# Altium schematic sheet 20180623.SchDoc
size A3
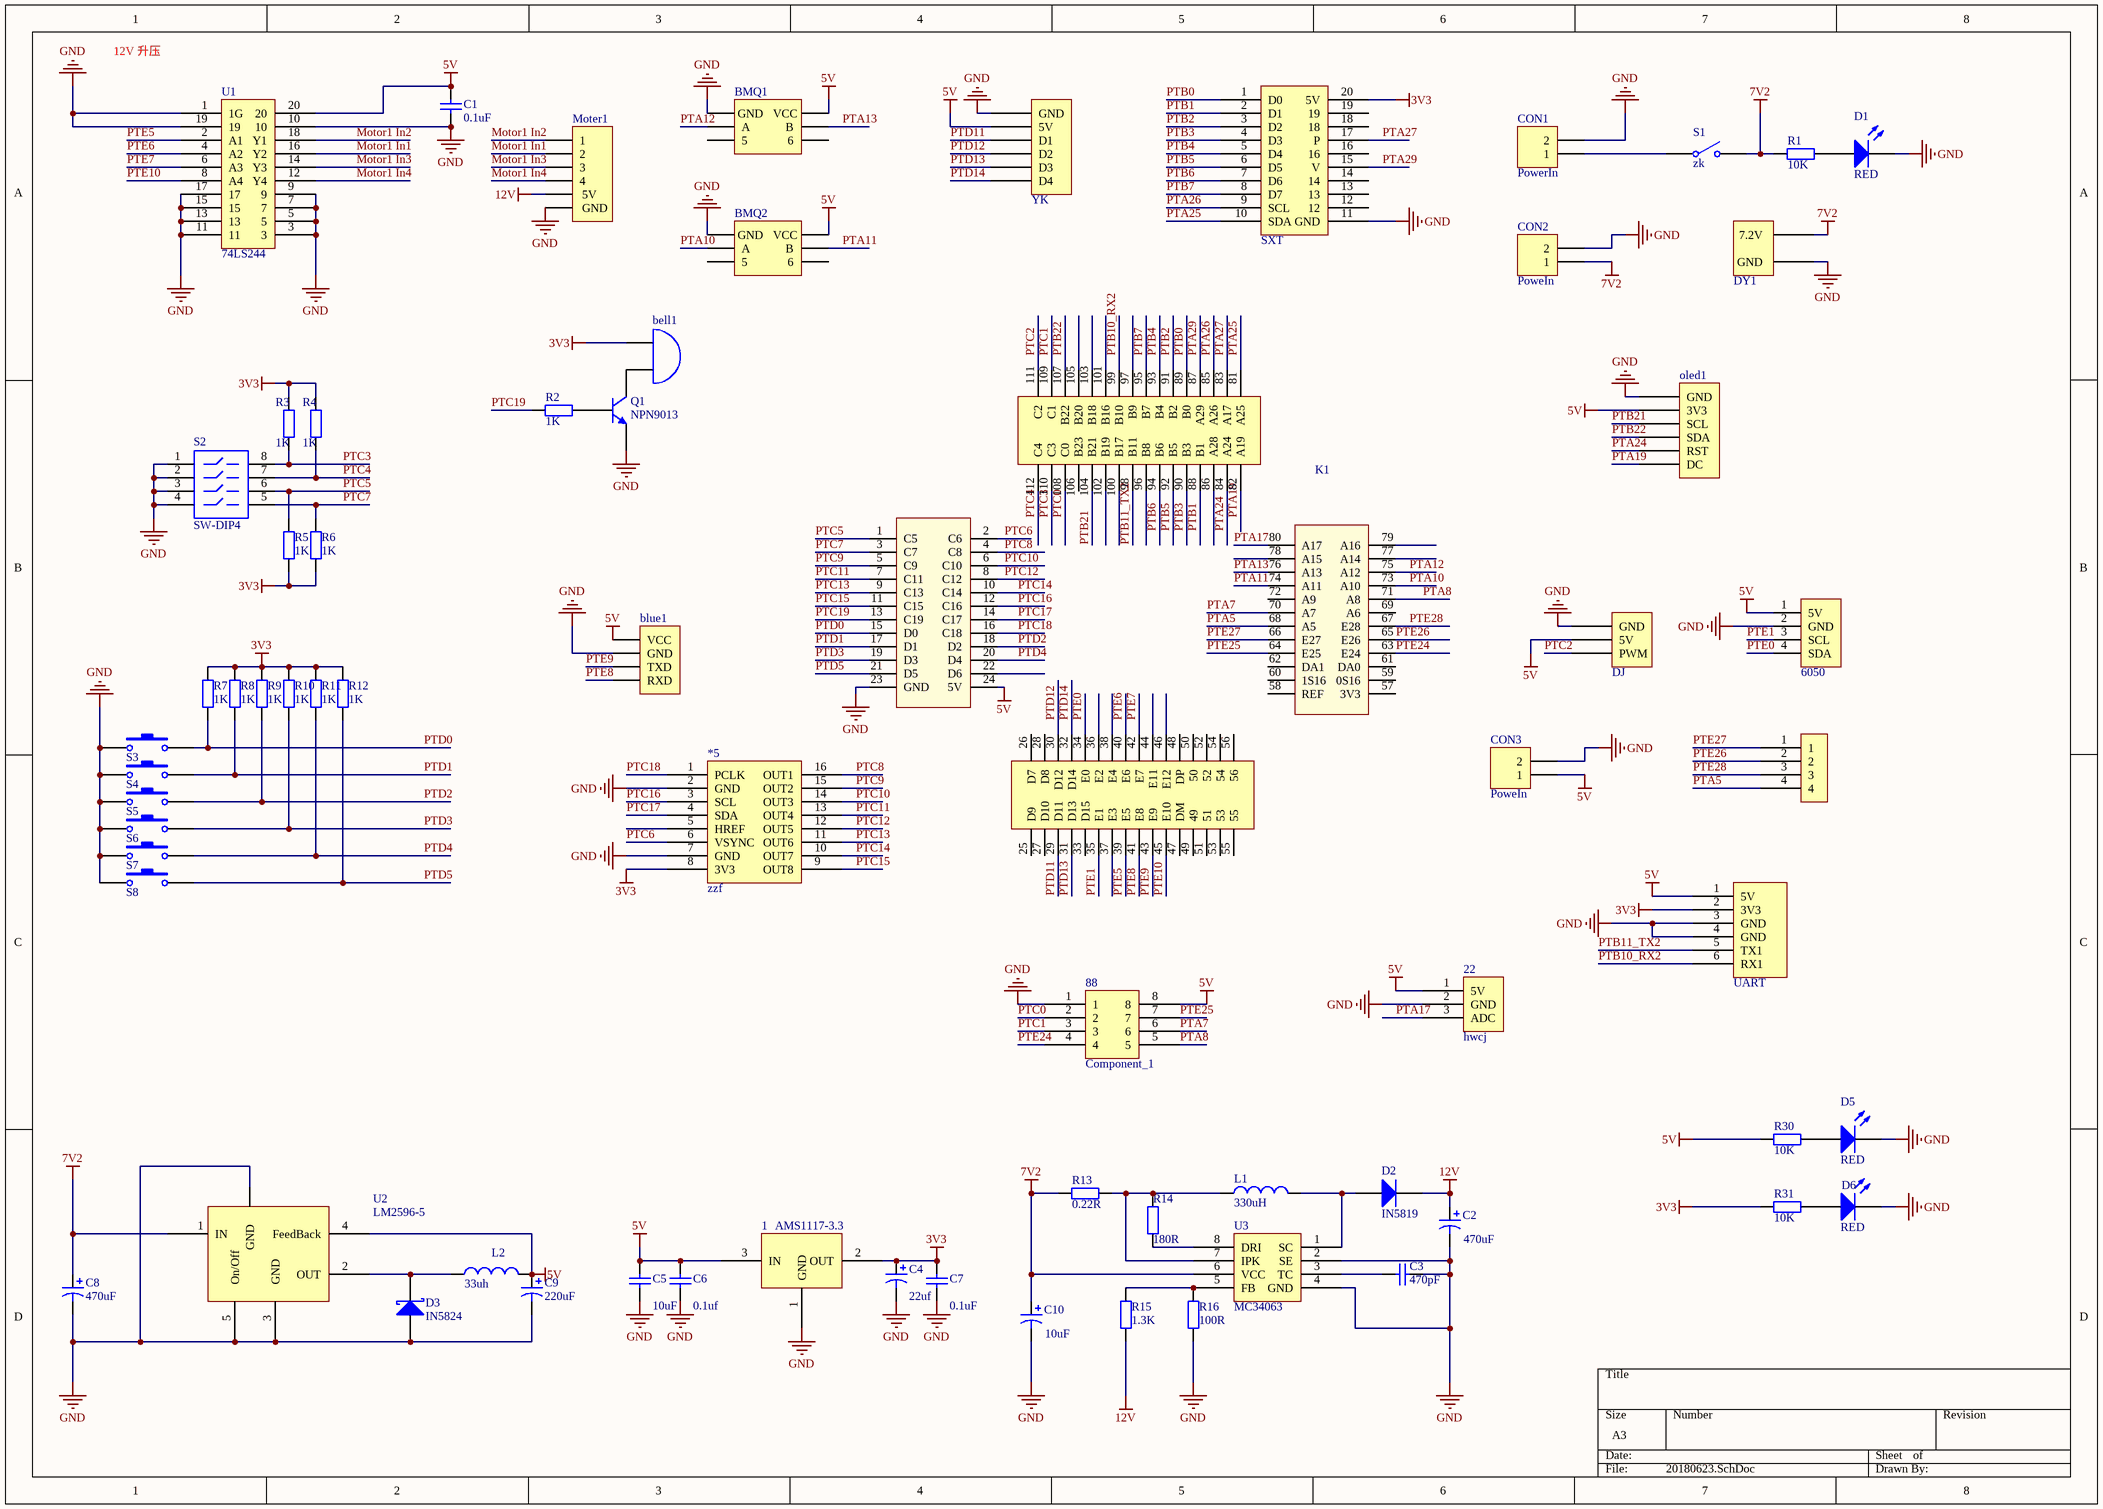
[diagram p0: 20180623.SchDoc]

## Parts
1  AMS1117-3.3  [lm1117-5v]
22  hwcj  [HDR1X3]
88  Component_1  [HDR2X4]
*  Component_1  [HDR1X4]  (value not drawn)
*1  SXT  [SXT]
*2  YK  [HDR1X6]
*3  6050  [HDR1X4]
*4  DJ  [HDR1X3]
*5  zzf  [HDR2X8]
?  UART  [HDR1X6]
bell1  Bell  [bezzer]  (value not drawn)
blue1  blueteeth2  [HDR1X4]  (value not drawn)
BMQ1  encode_1  [HDR2X3]  (value not drawn)
BMQ2  encode_2  [HDR2X3]  (value not drawn)
C1  0.1uF  [0805]
C2  470uF  [470UF]
C3  470pF  [0805]
C4  value 22uf  [0805]  (hidden comment: Cap Pol1)
C5  value 10uF  [0805]  (hidden comment: Cap)
C6  value 0.1uf  [0805]  (hidden comment: Cap)
C7  value 0.1uF  [0805]  (hidden comment: Cap)
C8  value 470uF  [470uF]  (hidden comment: Cap Pol1)
C9  value 220uF  [220uf]  (hidden comment: Cap Pol1)
C10  10uF  [0805]
CON1  PowerIn  [DIZUO]
CON2  PoweIn  [KF301-2P]
CON3  PoweIn  [HDR1X2]
D1  RED  [0805LED]
D2  IN5819  [1206(3216)]
D3  IN5824  [1N5824]
D5  RED  [0805LED]
D6  RED  [0805LED]
DY1  H1  [HDR1X2]  (value not drawn)
K1  K60  [K60_zk]  (value not drawn)
L1  330uH  [diangan]
L2  value 33uh  [diangan]  (hidden comment: Inductor)
Moter1  Motor  [HDR1X6]  (value not drawn)
oled1  OLED  [HDR1X6]  (value not drawn)
Q1  NPN9013  [npn9013]
R1  value 10K  [0805]  (hidden comment: Res2)
R2  value 1K  [0805]  (hidden comment: Res2)
R3  value 1K  [0805]  (hidden comment: Res2)
R4  value 1K  [0805]  (hidden comment: Res2)
R5  value 1K  [0805]  (hidden comment: Res2)
R6  value 1K  [0805]  (hidden comment: Res2)
R7  value 1K  [0805]  (hidden comment: Res2)
R8  value 1K  [0805]  (hidden comment: Res2)
R9  value 1K  [0805]  (hidden comment: Res2)
R10  value 1K  [0805]  (hidden comment: Res2)
R11  value 1K  [0805]  (hidden comment: Res2)
R12  value 1K  [0805]  (hidden comment: Res2)
R13  0.22R  [0805]
R14  180R  [0805]
R15  1.3K  [0805]
R16  100R  [0805]
R30  value 10K  [0805]  (hidden comment: Res2)
R31  value 10K  [0805]  (hidden comment: Res2)
S1  zk  [SWITCH-MID]
S2  SW-DIP4  [BMKG]
S3  SW-PB  [BUTTON]  (value not drawn)
S4  SW-PB  [BUTTON]  (value not drawn)
S5  SW-PB  [BUTTON]  (value not drawn)
S6  SW-PB  [BUTTON]  (value not drawn)
S7  SW-PB  [BUTTON]  (value not drawn)
S8  SW-PB  [BUTTON]  (value not drawn)
U1  74LS244  [74ls244DB]
U2  LM2596-5  [LM2596]
U3  MC34063  [MC34063]

## Nets
3V3: 1.2(OUT) *1.20(5V) *5.8(3V3) ?.2(3V3) bell1.1(A) C4.1 C7.2 R3.2 R4.2 R5.2 R6.1 R7.2 R8.2 R9.2 R10.2 R11.2 R12.2 R31.2
5V: 1.3(IN) 22.1(5V) 88.8 *2.2(5V) *3.1(5V) *4.2(5V) ?.1(5V) blue1.1(VCC) BMQ1.2(VCC) BMQ2.2(VCC) C1.2 C5.2 C6.2 C9.1 CON3.1 K1.24(5V) L2.2 oled1.2(3V3) R30.2 U1.20 U2.4(FeedBack)
7V2: C8.1 C10.1 CON2.1 DY1.2(7.2V) R1.2 R13.2 S1.2(NO) U2.1(IN) U3.6(VCC)
12V: C2.1 D2.2(K) Moter1.5(5V) R15.2
GND: 1.1(GND) 22.2(GND) 88.1 *1.11(GND) *2.1(GND) *3.2(GND) *4.1(GND) *5.2(GND) *5.7(GND) ?.3(GND) ?.4(GND) blue1.2(GND) BMQ1.1(GND) BMQ2.1(GND) C1.1 C2.2 C3.2 C4.2 C5.1 C6.1 C7.1 C8.2 C9.2 C10.2 CON1.2 CON2.2 CON3.2 D1.2(K) D3.2(K) D5.2(K) D6.2(K) DY1.1(GND) K1.23(GND) Moter1.6(GND) oled1.1(GND) Q1.1(E) R16.2 S2.1 S2.2 S2.3 S2.4 S3.1 S4.1 S5.1 S6.1 S7.1 S8.1 U1.1(1G) U1.3 U1.5 U1.7 U1.9 U1.10 U1.11 U1.13 U1.15 U1.17 U1.19 U2.3(GND) U2.5(On/Off) U2.6(GND) U3.2(SE) U3.4(GND)
Motor1 In1: Moter1.2 U1.16(Y2)
Motor1 In2: Moter1.1 U1.18(Y1)
Motor1 In3: Moter1.3 U1.14(Y3)
Motor1 In4: Moter1.4 U1.12(Y4)
PTA5: *.4 K1.68(A5)
PTA7: 88.6 K1.70(A7)
PTA8: 88.5 K1.71(A8)
PTA10: BMQ2.3(A) K1.73(A10)
PTA11: BMQ2.4(B) K1.74(A11)
PTA12: BMQ1.3(A) K1.75(A12)
PTA13: BMQ1.4(B) K1.76(A13)
PTA17: 22.3(ADC) K1.80(A17)
PTA19: K1.82(A19) oled1.6(DC)
PTA24: K1.84(A24) oled1.5(RST)
PTA25: *1.10(SDA) K1.81(A25)
PTA26: *1.9(SCL) K1.85(A26)
PTA27: *1.17(P) K1.83(A17)
PTA29: *1.15(V) K1.87(A29)
PTB0: *1.1(D0) K1.89(B0)
PTB1: *1.2(D1) K1.88(B1)
PTB2: *1.3(D2) K1.91(B2)
PTB3: *1.4(D3) K1.90(B3)
PTB4: *1.5(D4) K1.93(B4)
PTB5: *1.6(D5) K1.92(B5)
PTB6: *1.7(D6) K1.94(B6)
PTB7: *1.8(D7) K1.95(B7)
PTB10_RX2: ?.6(RX1) K1.99(B10)
PTB11_TX2: ?.5(TX1) K1.98(B11)
PTB21: K1.104(B21) oled1.3(SCL)
PTB22: K1.107(B22) oled1.4(SDA)
PTC0: 88.2 K1.108(C0)
PTC1: 88.3 K1.109(C1)
PTC2: *4.3(PWM) K1.111(C2)
PTC3: K1.110(C3) R3.1 S2.8
PTC4: K1.112(C4) R4.1 S2.7
PTC5: K1.1(C5) R5.1 S2.6
PTC6: *5.6(VSYNC) K1.2(C6)
PTC7: K1.3(C7) R6.2 S2.5
PTC8: *5.16(OUT1) K1.4(C8)
PTC9: *5.15(OUT2) K1.5(C9)
PTC10: *5.14(OUT3) K1.6(C10)
PTC11: *5.13(OUT4) K1.7(C11)
PTC12: *5.12(OUT5) K1.8(C12)
PTC13: *5.11(OUT6) K1.9(C13)
PTC14: *5.10(OUT7) K1.10(C14)
PTC15: *5.9(OUT8) K1.11(C15)
PTC16: *5.3(SCL) K1.12(C16)
PTC17: *5.4(SDA) K1.14(C17)
PTC18: *5.1(PCLK) K1.16(C18)
PTC19: K1.13(C19) R2.1
PTD0: K1.15(D0) R7.1 S3.2
PTD1: K1.17(D1) R8.1 S4.2
PTD2: K1.18(D2) R9.1 S5.2
PTD3: K1.19(D3) R10.1 S6.2
PTD4: K1.20(D4) R11.1 S7.2
PTD5: K1.21(D5) R12.1 S8.2
PTD11: *2.3(D1) K1.29(D11)
PTD12: *2.4(D2) K1.30(D12)
PTD13: *2.5(D3) K1.31(D13)
PTD14: *2.6(D4) K1.32(D14)
PTE0: *3.4(SDA) K1.34(E0)
PTE1: *3.3(SCL) K1.35(E1)
PTE5: K1.39(E5) U1.2(A1)
PTE6: K1.40(E6) U1.4(A2)
PTE7: K1.42(E7) U1.6(A3)
PTE8: blue1.4(RXD) K1.41(E8)
PTE9: blue1.3(TXD) K1.43(E9)
PTE10: K1.45(E10) U1.8(A4)
PTE24: 88.4 K1.63(E24)
PTE25: 88.7 K1.64(E25)
PTE26: *.2 K1.65(E26)
PTE27: *.1 K1.66(E27)
PTE28: *.3 K1.67(E28)
Netbell1_2: bell1.2(B) Q1.3(C)
NetC3_1: C3.1 U3.3(TC)
NetCON1_1: CON1.1 S1.1(COMMON)
NetD1_1: D1.1(A) R1.1
NetD2_1: D2.1(A) L1.2 U3.1(SC)
NetD3_1: D3.1(A) L2.1 U2.2(OUT)
NetD5_1: D5.1(A) R30.1
NetD6_1: D6.1(A) R31.1
NetL1_1: L1.1 R13.1 R14.2 U3.7(IPK)
NetQ1_2: Q1.2(B) R2.2
NetR14_1: R14.1 U3.8(DRI)
NetR15_1: R15.1 R16.1 U3.5(FB)

Not connected (* = marked no-connect by the designer): *1 12 13 14 16 18 19; *5 5(HREF); BMQ1 5 6; BMQ2 5 6; K1 22(D6) 25(D9) 26(D7) 27(D10) 28(D8) 33(D15) 36(E2) 37(E3) 38(E4) 44(E11) 46(E12) 47(DM) 48(DP) 49 50 51 52 53 54 55 56 57(3V3) 58(REF) 59(0S16) 60(1S16) 61(DA0) 62(DA1) 69(A6) 72(A9) 77(A14) 78(A15) 79(A16) 86(A28) 96(B8) 97(B9) 100(B17) 101(B16) 102(B19) 103(B18) 105(B20) 106(B23)

## Notes on the sheet
- 12V 升压

## Library data of the parts
1 = LT1117-3.3
*1 = 摄像头
*2 = 遥控
*4 = 舵机
bell1 = Bell: Electrical Bell; Published: 24-Mar-1999; LatestRevisionDate: 17-Jul-2002; LatestRevisionNote: Re-released for DXP Platform.; PackageReference: PIN2; Publisher: Altium Limited
blue1 = blueteeth
BMQ1 BMQ2 = encode
C1 C3 = Cap Semi: Capacitor (Semiconductor SIM Model); Published: 8-Jun-2000; LatestRevisionDate: 29-May-2009; LatestRevisionNote: IPC-7351 Footprint Added.; PackageReference: C1206; Publisher: Altium Limited; PackageDescription: Chip Capacitor
  C1: Value: 0.1uF
  C3: Value: 470pF
C2 C10 = Cap Pol3: Polarized Capacitor (Surface Mount); Published: 8-Jun-2000; LatestRevisionDate: 29-May-2009; LatestRevisionNote: IPC-7351 Footprint Added.; PackageReference: C0805; Publisher: Altium Limited; PackageDescription: Chip Capacitor
  C2: Value: 470uF
  C10: Value: 10uF
C4 C8 C9 = Cap Pol1: Polarized Capacitor (Radial); Published: 8-Jun-2000; LatestRevisionDate: 17-Jul-2002; LatestRevisionNote: Re-released for DXP Platform.; PackageReference: RB7.6-15; Publisher: Altium Limited; PackageDescription: Polarized Capacitor (Radial); 2 Leads
C5-C7 = Cap: Capacitor; Published: 8-Jun-2000; LatestRevisionDate: 17-Jul-2002; LatestRevisionNote: Re-released for DXP Platform.; PackageReference: RAD-0.3; Publisher: Altium Limited; PackageDescription: Radial Cap, Thru-Hole; 2 Leads; 0.3 in Pin Spacing
CON1-CON3 = Header 2: Header, 2-Pin; LatestRevisionDate: 17-Jul-2002; LatestRevisionNote: Re-released for DXP Platform.; Publisher: Altium Limited
D1 D5 D6 = LED2: Typical RED, GREEN, YELLOW, AMBER GaAs LED; Published: 8-Jun-2000; LatestRevisionDate: 17-Jul-2002; LatestRevisionNote: Re-released for DXP Platform.; PackageVersion: Feb-2002; PackageReference: 3.2X1.6X1.1; Publisher: Altium Limited; PackageDescription: SM LED; 2 Flat Leads
D2 = Diode: Default Diode; Published: 8-Jun-2000; LatestRevisionDate: 17-Jul-2002; LatestRevisionNote: Re-released for DXP Platform.; PackageVersion: Sep-1996; PackageReference: SMC; Publisher: Altium Limited; PackageDescription: DO-214-AB/SMC; 2 C-Bend Leads; Body 7.9 x 5.9 mm, inc. leads (LxW); Code_JEDEC: DO-214-AB
L1 L2 = Inductor: Code_IEC: 1005; Published: 8-Jun-2000; LatestRevisionDate: 29-May-2009; LatestRevisionNote: IPC-7351 Footprint Added.; PackageReference: 0402-A; Publisher: Altium Limited; PackageDescription: Chip Inductor; Code_JEITA: 0402
  L1: Value: 330uH
Q1 = 2N3904: NPN General Purpose Amplifier; Published: 8-Jun-2000; LatestRevisionDate: 15-Jan-2003; LatestRevisionNote: PCB Footprint 'BCY-W3/D4.7' replaced; DatasheetVersion: 1997; PackageVersion: Sep-1998; PackageReference: TO-92A; Publisher: Altium Limited; PackageDescription: TO, Flat Index; 3 In-Line, Axial Leads; Body Dia. 4.5mm; Leads 0.51 x 0.48 mm (max); ComponentLink1Description: Manufacturer Link; ComponentLink1URL: http://www.fairchildsemi.com/; ComponentLink2Description: Datasheet; ComponentLink2URL: http://www.fairchildsemi.com/ds/2N%2F2N3904.pdf
R1-R16 R30 R31 = Res2: Resistor; Published: 8-Jun-2000; LatestRevisionDate: 17-Jul-2002; LatestRevisionNote: Re-released for DXP Platform.; PackageReference: AXIAL-0.4; Publisher: Altium Limited; PackageDescription: Axial Device, Thru-Hole; 2 Leads; 0.4 in Pin Spacing
  R13: Value: 0.22R
  R14: Value: 180R
  R15: Value: 1.3K
  R16: Value: 100R
S1 = SW-SPST: Single-Pole, Single-Throw Switch; Published: 24-Mar-1999; LatestRevisionDate: 17-Jul-2002; LatestRevisionNote: Re-released for DXP Platform.; PackageReference: SPST-2; Publisher: Altium Limited; PackageDescription: Switch; 2 Leads
S2 = SW-DIP4: DIP Switch; Published: 24-Mar-1999; LatestRevisionDate: 17-Jul-2002; LatestRevisionNote: Re-released for DXP Platform.; PackageReference: DIP-8; Publisher: Altium Limited
S3-S8 = SW-PB: Switch; Published: 24-Mar-1999; LatestRevisionDate: 17-Jul-2002; LatestRevisionNote: Re-released for DXP Platform.; PackageReference: SPST-2; Publisher: Altium Limited; PackageDescription: Switch; 2 Leads
U2 = LM2596